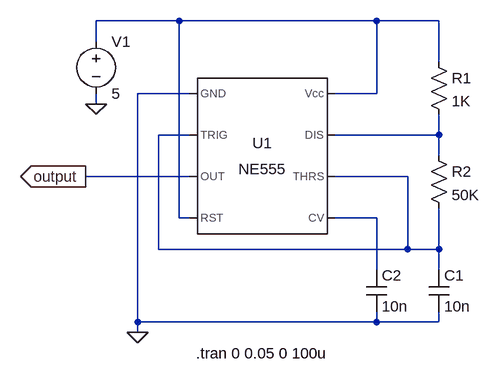
[diagram p0: schematic LM555.asc]
LM555.asc, the LTspice schematic file:
Version 4
SHEET 1 880 680
WIRE 80 -16 -48 -16
WIRE 384 -16 80 -16
WIRE 480 -16 384 -16
WIRE -48 16 -48 -16
WIRE 480 48 480 -16
WIRE 96 96 16 96
WIRE 384 96 384 -16
WIRE 384 96 320 96
WIRE -48 112 -48 96
WIRE 96 160 48 160
WIRE 480 160 480 128
WIRE 480 160 320 160
WIRE 480 192 480 160
WIRE 96 224 -64 224
WIRE 432 224 320 224
WIRE 80 288 80 -16
WIRE 96 288 80 288
WIRE 384 288 320 288
WIRE 48 336 48 160
WIRE 432 336 432 224
WIRE 432 336 48 336
WIRE 480 336 480 272
WIRE 480 336 432 336
WIRE 384 368 384 288
WIRE 480 368 480 336
WIRE 16 448 16 96
WIRE 384 448 384 432
WIRE 384 448 16 448
WIRE 480 448 480 432
WIRE 480 448 384 448
WIRE 16 464 16 448
FLAG 16 464 0
FLAG -48 112 0
FLAG -64 224 output
IOPIN -64 224 Out
SYMBOL Misc\\NE555 208 192 R0
SYMATTR InstName U1
SYMBOL cap 368 368 R0
SYMATTR InstName C2
SYMATTR Value 10n
SYMBOL cap 464 368 R0
SYMATTR InstName C1
SYMATTR Value 10n
SYMBOL res 464 176 R0
SYMATTR InstName R2
SYMATTR Value 50K
SYMATTR SpiceLine tol=1 pwr=0.1
SYMBOL res 464 32 R0
SYMATTR InstName R1
SYMATTR Value 1K
SYMATTR SpiceLine tol=1 pwr=0.1
SYMBOL voltage -48 0 R0
WINDOW 123 0 0 Left 0
WINDOW 39 0 0 Left 0
SYMATTR InstName V1
SYMATTR Value 5
TEXT 106 496 Left 2 !.tran 0 0.05 0 100u

The netlist it stands for:
* LM555.asc
XU1 0 N002 output N001 N004 N002 N003 N001 NE555  ; pins GND TRIG OUT RST CV THRS DIS Vcc
C2 N004 0 10n
C1 N002 0 10n
R2 N003 N002 50K tol=1 pwr=0.1
R1 N001 N003 1K tol=1 pwr=0.1
V1 N001 0 5
.tran 0 0.05 0 100u
.lib NE555.sub
.backanno
.end